# EAGLE design PEAWS (EAGLE 7.2.0)

## Sheet 1 of 5
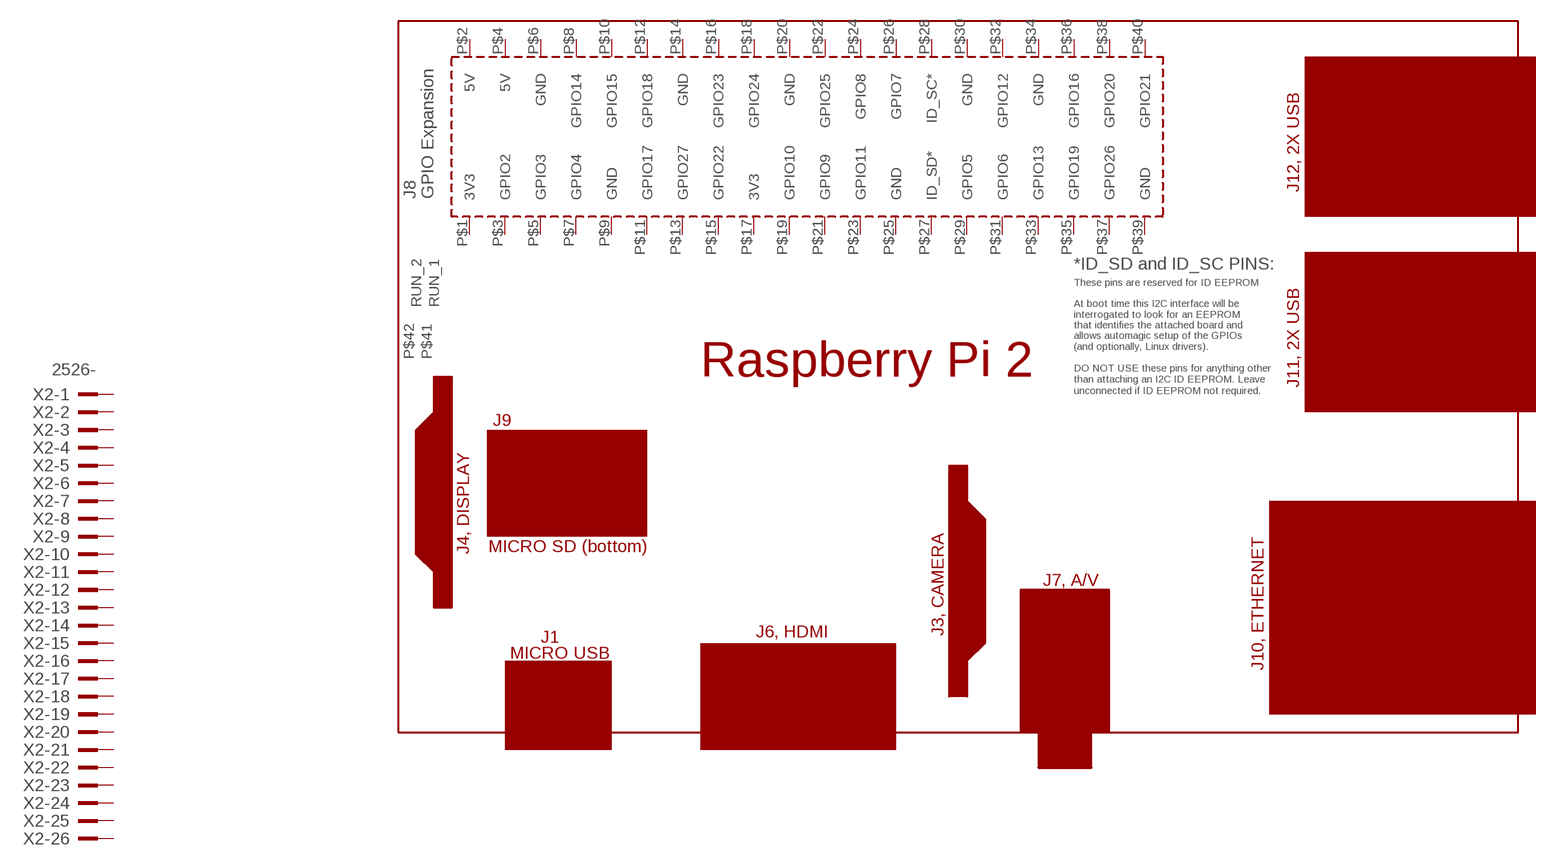
[diagram p0: schematic, sheet 1]

### Parts
PCB1  RPI2  [RPI2]
X2  2526-  [PAK100/2500-26]
Unconnected: PCB1.P$1(3V3) PCB1.P$2(5V) PCB1.P$3(GPIO2) PCB1.P$4(5V) PCB1.P$5(GPIO3) PCB1.P$6(GND) PCB1.P$7(GPIO4) PCB1.P$8(GPIO14) PCB1.P$9(GND) PCB1.P$10(GPIO15) PCB1.P$11(GPIO17) PCB1.P$12(GPIO18) PCB1.P$13(GPIO27) PCB1.P$14(GND) PCB1.P$15(GPIO22) PCB1.P$16(GPIO23) PCB1.P$17(3V3) PCB1.P$18(GPIO24) PCB1.P$19(GPIO10) PCB1.P$20(GND) PCB1.P$21(GPIO9) PCB1.P$22(GPIO25) PCB1.P$23(GPIO11) PCB1.P$24(GPIO8) PCB1.P$25(GND) PCB1.P$26(GPIO7) PCB1.P$27(ID_SD*) PCB1.P$28(ID_SC*) PCB1.P$29(GPIO5) PCB1.P$30(GND) PCB1.P$31(GPIO6) PCB1.P$32(GPIO12) PCB1.P$33(GPIO13) PCB1.P$34(GND) PCB1.P$35(GPIO19) PCB1.P$36(GPIO16) PCB1.P$37(GPIO26) PCB1.P$38(GPIO20) PCB1.P$39(GND) PCB1.P$40(GPIO21) PCB1.P$41(RUN_1) PCB1.P$42(RUN_2) X2.1 X2.2 X2.3 X2.4 X2.5 X2.6 X2.7 X2.8 X2.9 X2.10 X2.11 X2.12 X2.13 X2.14 X2.15 X2.16 X2.17 X2.18 X2.19 X2.20 X2.21 X2.22 X2.23 X2.24 X2.25 X2.26

## Sheet 2 of 5
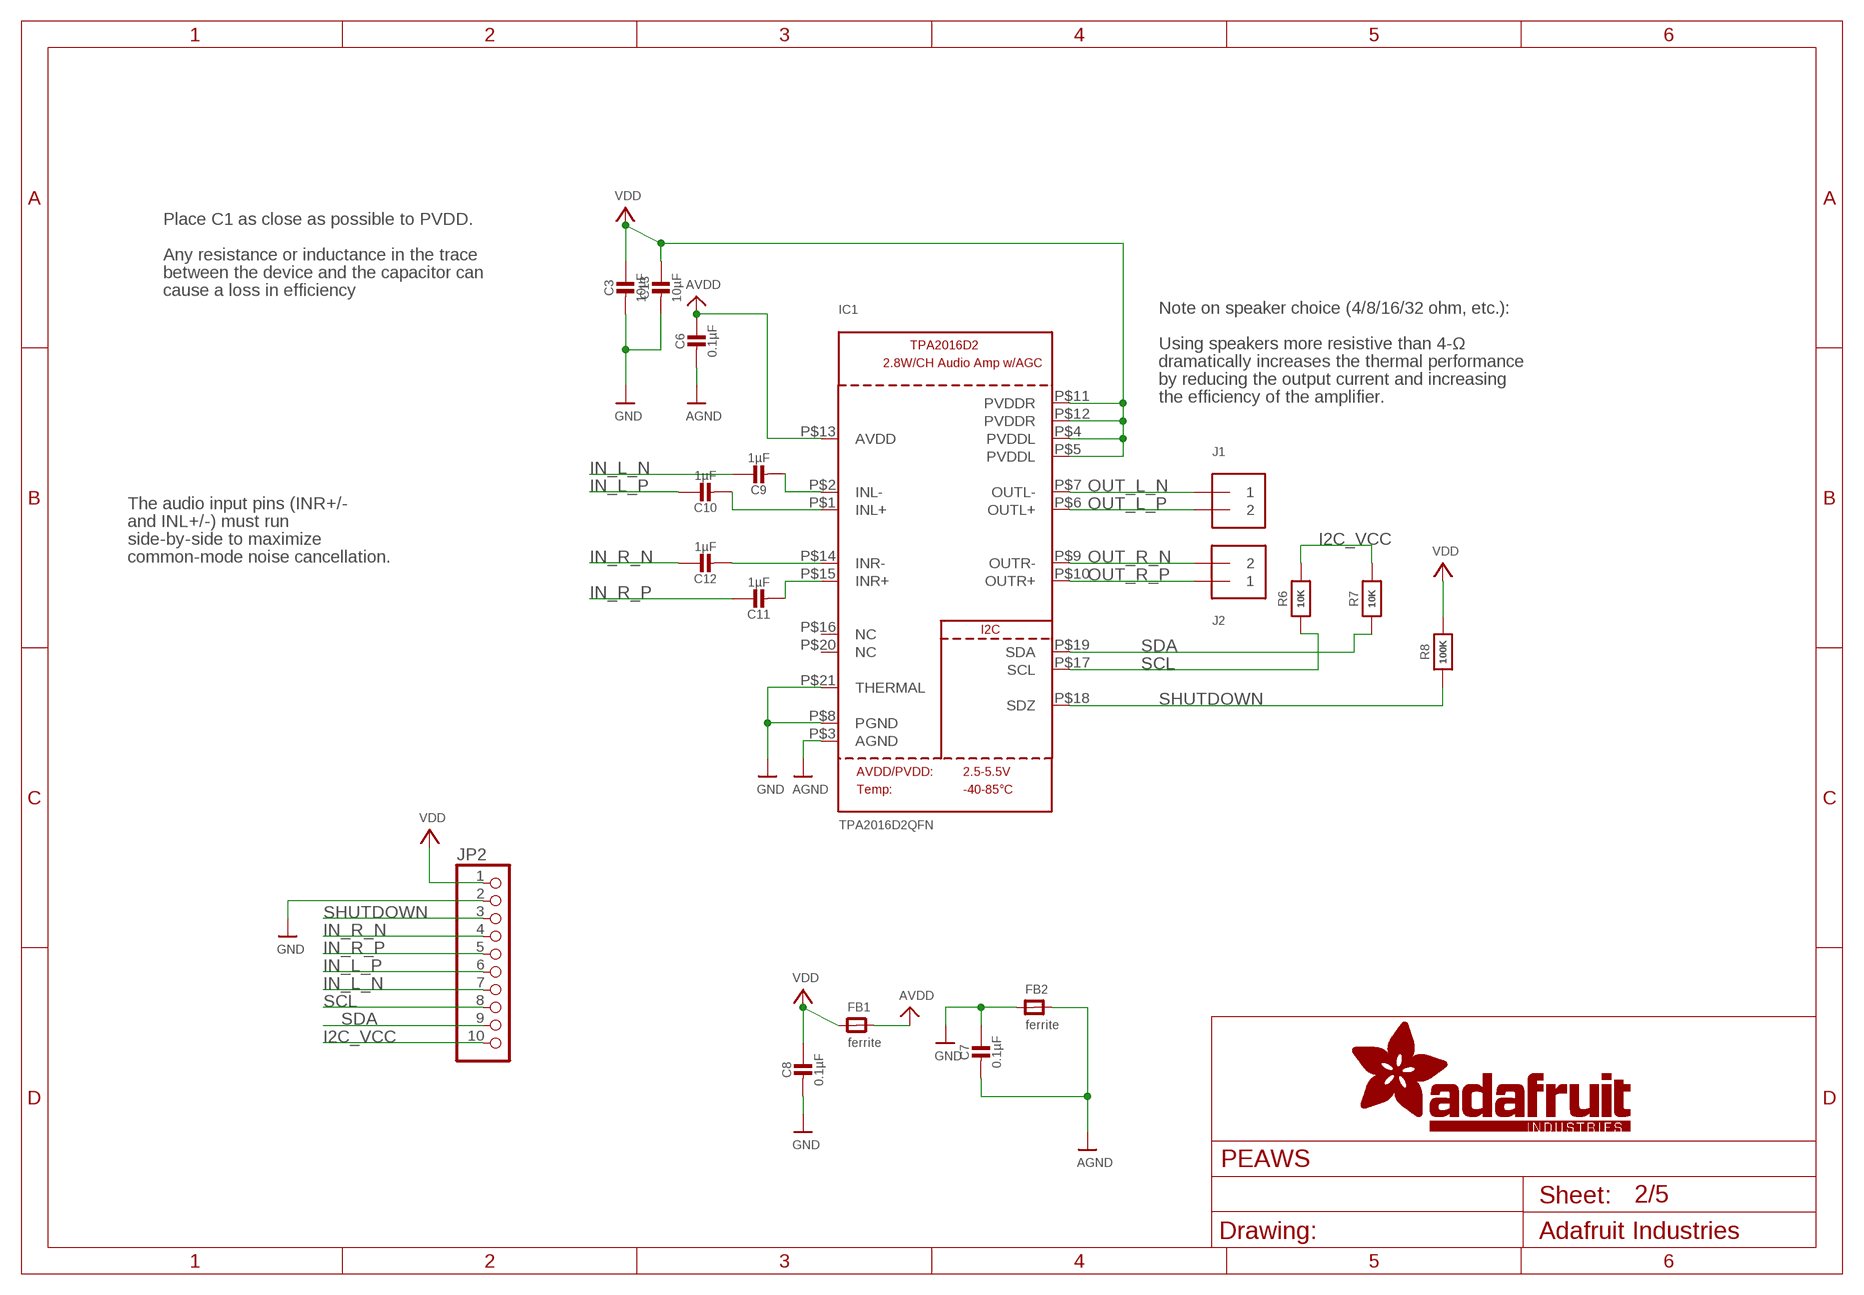
[diagram p1: schematic, sheet 2]

### Parts
C3  10µF  CAP_CERAMIC0805-NOOUTLINE  [0805-NO]
C6  0.1µF  CAP_CERAMIC0805-NOOUTLINE  [0805-NO]
C7  0.1µF  CAP_CERAMIC0805-NOOUTLINE  [0805-NO]
C8  0.1µF  CAP_CERAMIC0805-NOOUTLINE  [0805-NO]
C9  1µF  CAP_CERAMIC0805-NOOUTLINE  [0805-NO]
C10  1µF  CAP_CERAMIC0805-NOOUTLINE  [0805-NO]
C11  1µF  CAP_CERAMIC0805-NOOUTLINE  [0805-NO]
C12  1µF  CAP_CERAMIC0805-NOOUTLINE  [0805-NO]
C13  10µF  CAP_CERAMIC0805-NOOUTLINE  [0805-NO]
FB1  ferrite  FERRITE_0805MP  [_0805MP]
FB2  ferrite  FERRITE_0805MP  [_0805MP]
IC1  TPA2016D2QFN  [QFN20_4MM]
J1  TERMBLOCK_1X2  [TERMBLOCK_1X2-3.5MM]
J2  TERMBLOCK_1X2  [TERMBLOCK_1X2-3.5MM]
JP2  HEADER-1X1070MIL  [1X10_ROUND70]
R6  10K  RESISTOR0805_NOOUTLINE  [0805-NO]
R7  10K  RESISTOR0805_NOOUTLINE  [0805-NO]
R8  100K  RESISTOR0805_NOOUTLINE  [0805-NO]

### Nets
AGND: C6.2 C7.2 FB2.2 IC1.P$3(AGND)
AVDD: C6.1 FB1.2 IC1.P$13(AVDD)
GND: C3.2 C7.1 C8.2 C13.2 FB2.1 IC1.P$8(PGND) IC1.P$21(THERMAL) JP2.2 ; also sheet 3,4,5
I2C_VCC: JP2.10 R6.2 R7.2
IN_L_N: C9.1 JP2.7
IN_L_P: C10.1 JP2.6
IN_R_N: C12.1 JP2.4
IN_R_P: C11.1 JP2.5
N$6: C10.2 IC1.P$1(INL+)
N$7: C9.2 IC1.P$2(INL-)
N$8: C12.2 IC1.P$14(INR-)
N$9: C11.2 IC1.P$15(INR+)
OUT_L_N: IC1.P$7(OUTL-) J1.1
OUT_L_P: IC1.P$6(OUTL+) J1.2
OUT_R_N: IC1.P$9(OUTR-) J2.2
OUT_R_P: IC1.P$10(OUTR+) J2.1
SCL: IC1.P$17(SCL) JP2.8 R6.1
SDA: IC1.P$19(SDA) JP2.9 R7.1
SHUTDOWN: IC1.P$18(SDZ) JP2.3 R8.1
VDD: C3.1 C8.1 C13.1 FB1.1 IC1.P$4(PVDDL) IC1.P$5(PVDDL) IC1.P$11(PVDDR) IC1.P$12(PVDDR) JP2.1 R8.2 ; also sheet 3
Unconnected: IC1.P$16(NC) IC1.P$20(NC)

### Notes on the sheet
- Place C1 as close as possible to PVDD.
- Any resistance or inductance in the trace
- between the device and the capacitor can
- cause a loss in efficiency
- Note on speaker choice (4/8/16/32 ohm, etc.):
- Using speakers more resistive than 4-Ω
- dramatically increases the thermal performance
- by reducing the output current and increasing
- the efficiency of the amplifier.
- The audio input pins (INR+/-
- and INL+/-) must run
- side-by-side to maximize
- common-mode noise cancellation.

## Sheet 3 of 5
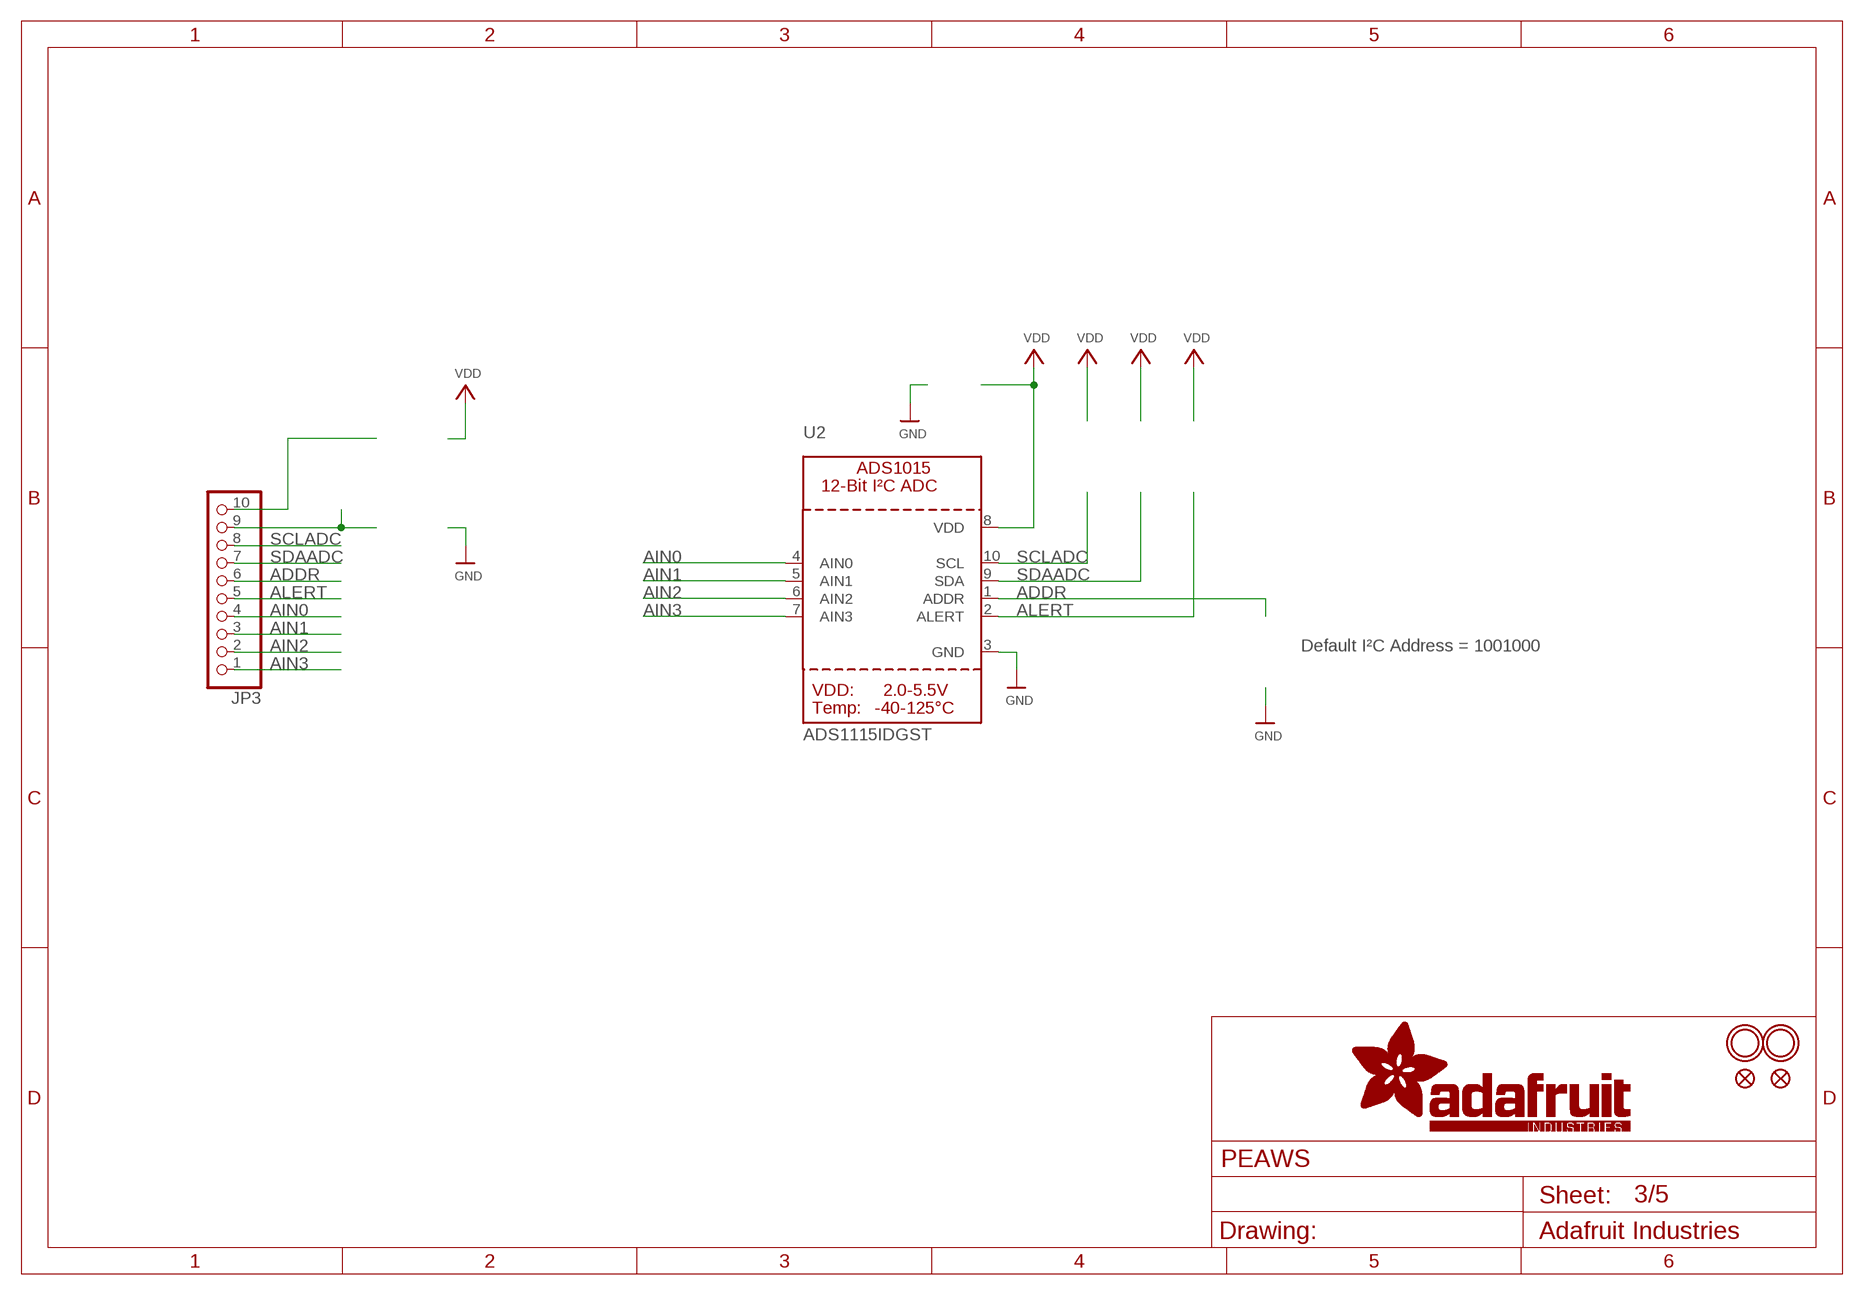
[diagram p2: schematic, sheet 3]

### Parts
FID1  FIDUCIAL""  [FIDUCIAL_1MM]
FID2  FIDUCIAL""  [FIDUCIAL_1MM]
JP3  HEADER-1X1070MIL  [1X10_ROUND70]
U2  ADS1115IDGST  ADC_ADS1015  [MSOP10]
U$55  MOUNTINGHOLE2.5  [MOUNTINGHOLE_2.5_PLATED]
U$56  MOUNTINGHOLE2.5  [MOUNTINGHOLE_2.5_PLATED]

### Nets
ADDR: JP3.6 U2.1(ADDR)
AIN0: JP3.4 U2.4(AIN0)
AIN1: JP3.3 U2.5(AIN1)
AIN2: JP3.2 U2.6(AIN2)
AIN3: JP3.1 U2.7(AIN3)
ALERT: JP3.5 U2.2(ALERT)
GND: U2.3(GND) ; also sheet 2,4,5
N$11: JP3.9
N$12: JP3.10
SCLADC: JP3.8 U2.10(SCL)
SDAADC: JP3.7 U2.9(SDA)
VDD: U2.8(VDD) ; also sheet 2

### Notes on the sheet
- Default I²C Address = 1001000

## Sheet 4 of 5
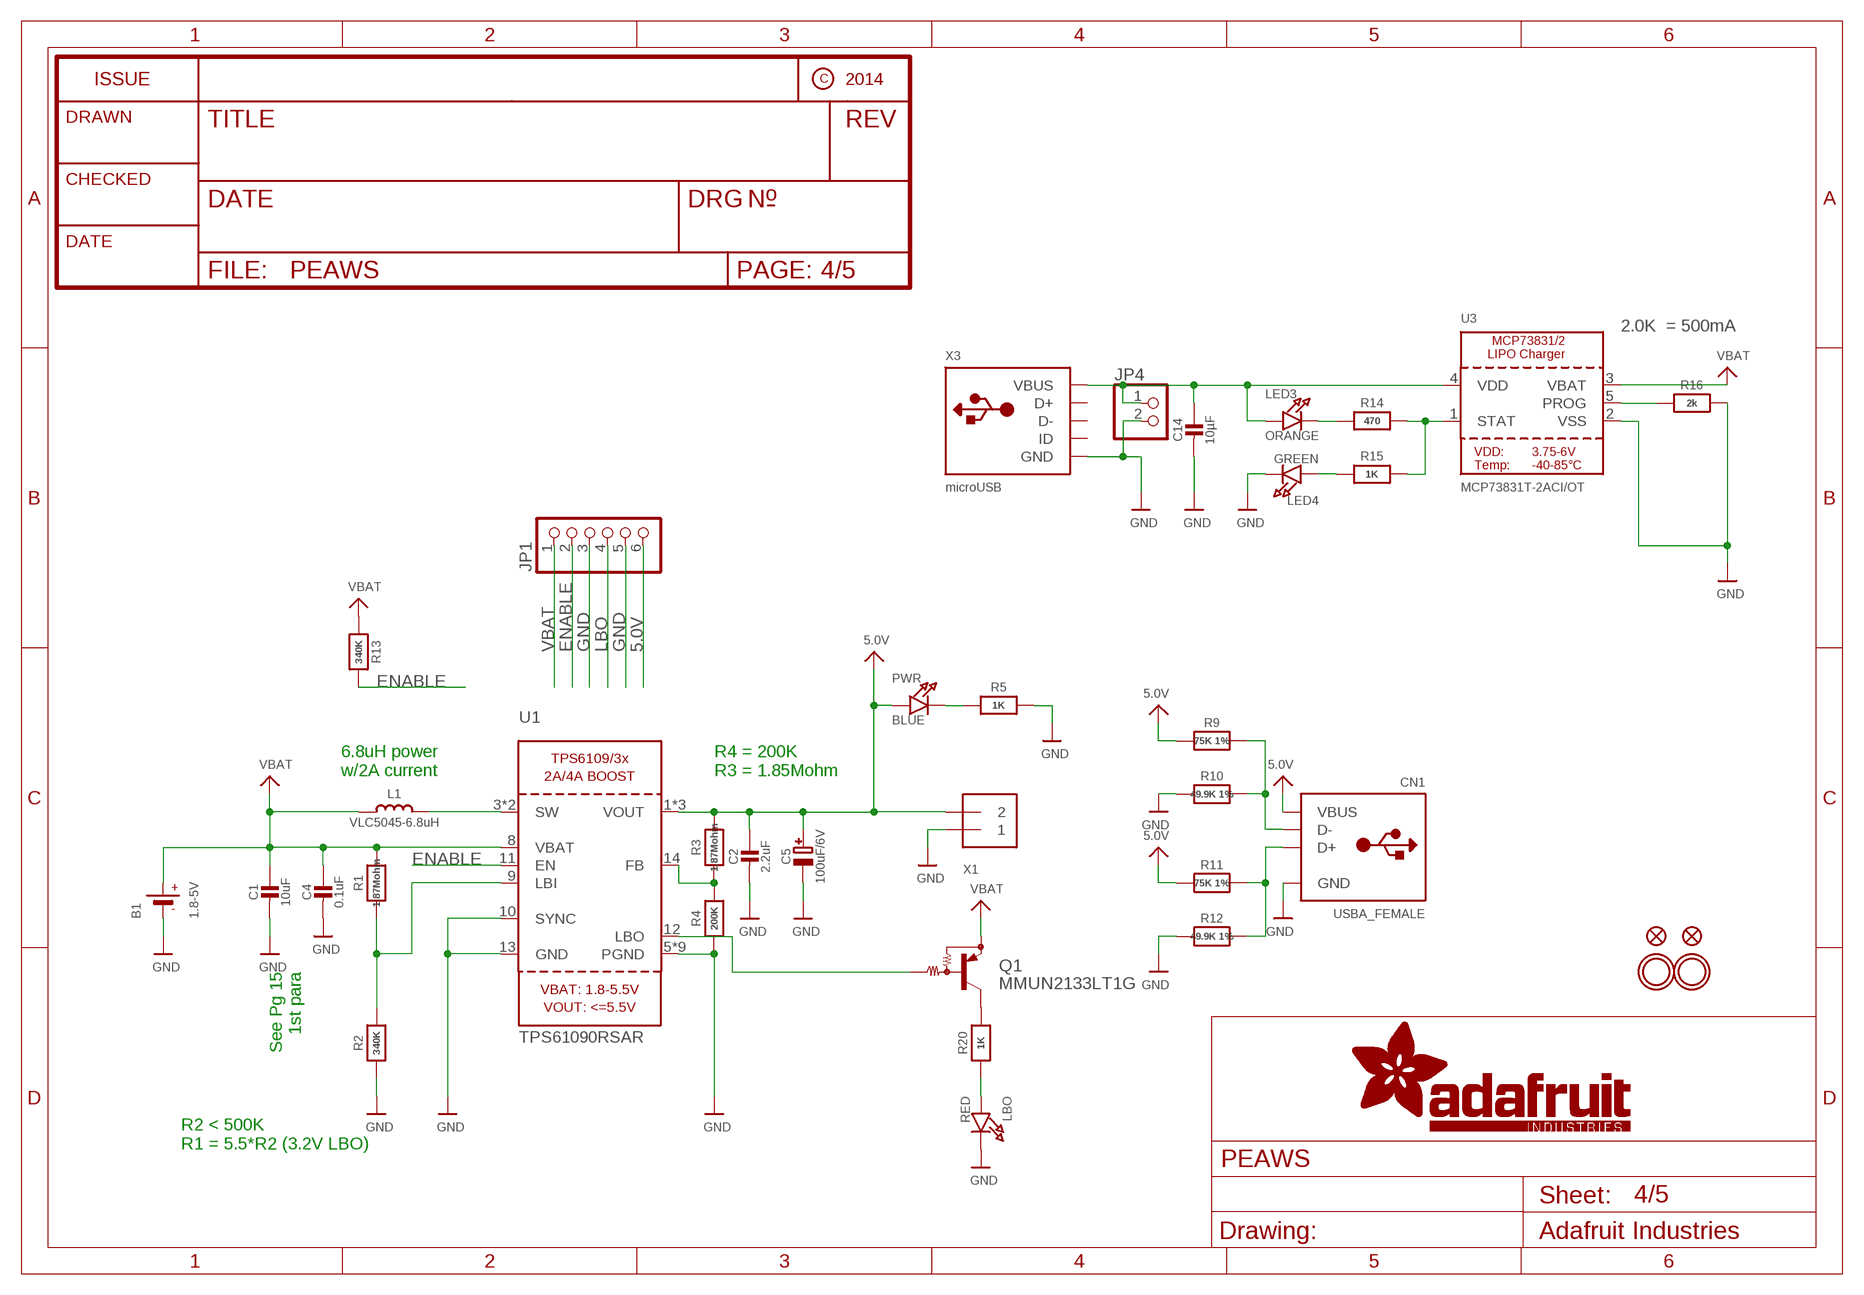
[diagram p3: schematic, sheet 4]

### Parts
B1  1.8-5V  BATTERY  [JSTPH2]
C1  10uF  CAP_CERAMIC0805-NOOUTLINE  [0805-NO]
C2  2.2uF  CAP_CERAMIC0805-NOOUTLINE  [0805-NO]
C4  0.1uF  CAP_CERAMIC0805-NOOUTLINE  [0805-NO]
C5  100uF/6V  CAP_TANTALUMB/3528_REFLOW  [EIA3528-21/B-R]
C14  10µF  CAP_CERAMIC0805-NOOUTLINE  [0805-NO]
CN1  USBA_FEMALE  USB_TYPEAPTHFML  [USB_HOST-PTH]
FID3  FIDUCIAL""  [FIDUCIAL_1MM]
FID4  FIDUCIAL""  [FIDUCIAL_1MM]
JP1  PINHD-1X6CB  [1X06-CLEANBIG]
JP4  HEADER-1X2ROUND  [1X02_ROUND]
L1  VLC5045-6.8uH  INDUCTORTDK_VLC5045  [INDUCTOR_5X5MM_TDK_VLC5045]
LBO  RED  LED0805_NOOUTLINE  [CHIPLED_0805_NOOUTLINE]
LED3  ORANGE  LED0805_NOOUTLINE  [CHIPLED_0805_NOOUTLINE]
LED4  GREEN  LED0805_NOOUTLINE  [CHIPLED_0805_NOOUTLINE]
PWR  BLUE  LED0805_NOOUTLINE  [CHIPLED_0805_NOOUTLINE]
Q1  MMUN2133LT1G  MUN2114T1-PNP_DRIVER-SC59-BEC  [SC59-BEC]
R1  1.87Mohm  RESISTOR0805_NOOUTLINE  [0805-NO]
R2  340K  RESISTOR0805_NOOUTLINE  [0805-NO]
R3  1.87Mohm  RESISTOR0805_NOOUTLINE  [0805-NO]
R4  200K  RESISTOR0805_NOOUTLINE  [0805-NO]
R5  1K  RESISTOR0805_NOOUTLINE  [0805-NO]
R9  75K 1%  RESISTOR0805_NOOUTLINE  [0805-NO]
R10  49.9K 1%  RESISTOR0805_NOOUTLINE  [0805-NO]
R11  75K 1%  RESISTOR0805_NOOUTLINE  [0805-NO]
R12  49.9K 1%  RESISTOR0805_NOOUTLINE  [0805-NO]
R13  340K  RESISTOR0805_NOOUTLINE  [0805-NO]
R14  470  RESISTOR0805_NOOUTLINE  [0805-NO]
R15  1K  RESISTOR0805_NOOUTLINE  [0805-NO]
R16  2k  RESISTOR0805_NOOUTLINE  [0805-NO]
R20  1K  RESISTOR0805_NOOUTLINE  [0805-NO]
U1  TPS61090RSAR  VREG_TPS6103X  [PVQFN-16]
U3  MCP73831T-2ACI/OT  MCP73831/2  [SOT23-5]
U$3  MOUNTINGHOLE2.5  [MOUNTINGHOLE_2.5_PLATED]
U$6  MOUNTINGHOLE2.5  [MOUNTINGHOLE_2.5_PLATED]
X1  TERMBLOCK_1X2  [TERMBLOCK_1X2-3.5MM]
X3  microUSB  USBMICRO_20329  [4UCONN_20329]

### Nets
5.0V: C2.1 C5.+ CN1.VBUS JP1.6 PWR.A R3.2 R9.2 R11.2 U1.1(VOUT) U1.15(VOUT) U1.16(VOUT) X1.2 ; also sheet 5
D+: CN1.D+ R11.1 R12.1
D-: CN1.D- R9.1 R10.1
ENABLE: JP1.2 R13.2 U1.11(EN)
GND: B1.1(-) C1.2 C2.2 C4.2 C5.- C14.2 CN1.GND JP1.3 JP1.5 JP4.2 LBO.C LED4.C R2.1 R4.1 R5.2 R10.2 R12.2 R16.2 U1.5(PGND) U1.6(PGND) U1.7(PGND) U1.10(SYNC) U1.13(GND) U1.P$18(PGND) U1.P$19(PGND) U1.P$20(PGND) U1.P$21(PGND) U1.P$22(PGND) U1.THERMAL(PGND) U3.2(VSS) X1.1 X3.BASE@1(GND) X3.BASE@2(GND) X3.GND X3.SPRT@1(GND) X3.SPRT@2(GND) X3.SPRT@3(GND) X3.SPRT@4(GND) ; also sheet 2,3,5
LBO: JP1.4 Q1.B U1.12(LBO)
N$25: L1.P$2 U1.3(SW) U1.4(SW)
N$26: R1.1 R2.2 U1.9(LBI)
N$27: PWR.C R5.1
N$28: R3.1 R4.2 U1.14(FB)
N$29: LBO.A R20.1
N$30: Q1.C R20.2
N$31: LED3.C R14.1
N$32: R14.2 R15.2 U3.1(STAT)
N$33: R16.1 U3.5(PROG)
N$34: LED4.A R15.1
VBAT: B1.2(+) C1.1 C4.1 JP1.1 L1.P$1 Q1.E R1.2 R13.1 U1.8(VBAT) U3.3(VBAT)
VDD1: C14.1 JP4.1 LED3.A U3.4(VDD) X3.VBUS
Unconnected: X3.D+ X3.D- X3.ID

### Notes on the sheet
- 2.0K  = 500mA
- 6.8uH power
  w/2A current
- R4 = 200K
  R3 = 1.85Mohm
- See Pg 15
  1st para
- R2 < 500K
  R1 = 5.5*R2 (3.2V LBO)

## Sheet 5 of 5
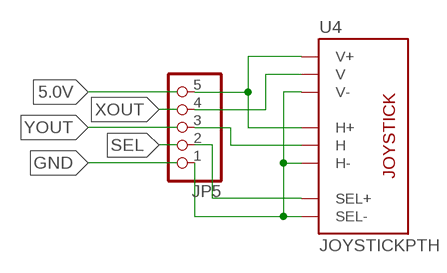
[diagram p4: schematic, sheet 5]

### Parts
JP5  PINHD-1X5  [1X05]
U4  JOYSTICKPTH  [JOYSTICK]

### Nets
N$1: JP5.5 U4.H1(H+) U4.V1(V+)
N$2: JP5.1 U4.B2A(SEL-) U4.H3(H-) U4.V3(V-)
N$3: JP5.4 U4.V2(V)
N$4: JP5.3 U4.H2(H)
N$5: JP5.2 U4.B1A(SEL+)

## Library data of the parts
B1 = microbuilder:BATTERY: CR1220 SMT - Digikey: 3001K-ND CD2032 BAT-HLD-001 - Digikey: BAT-HLD-001-ND
C1-C4 C6-C14 = microbuilder:CAP_CERAMIC: Ceramic Capacitors For new designs, use the packages preceded by an '_' character since they are more reliable: The following footprints should be used on most boards: _0402 - Standard footprint for regular board layouts _0603 - Standard footprint for regular board layouts _0805 - Standard footprint for regular board layouts _1206 - Standard footprint for regular board layouts For extremely tight-pitch boards where space is at a premium, the following 'micro-pitch' footprints can be used (smaller pads, no silkscreen outline, etc.): _0402MP - Micro-pitch footprint for very dense/compact boards _0603MP - Micro-pitch footprint for very dense/compact boards _0805MP - Micro-pitch footprint for very dense/compact boards _1206MP - Micro-pitch footprint for very dense/compact boards
C5 = microbuilder:CAP_TANTALUM: Tantalum Capacitors Wave footprints have larger pads and are meant to be used for hand soldering. Reflow footprints are optimised for solder paste and a reflow oven. EIA3216-18/A-[R/W] - Size A / 3216-18 / 1206 footprint 4.7µF 25V 10% Tantalum Capacitor 10µF 16V 10% Tantalum Capacitor [Digikey: 495-2236-2-ND] EIA3528-21/B-[R/W] - Size B / 3528-21 47µF 10V 10% Tantalum Capactior [Digikey: 495-2216-1-ND] EIA6032-28/C-[R/W] - Size C / 6032-28 10µF 35V 20% Tantalum Capacitor [Digikey: 495-2285-1-ND] 100µF 16V 10% Tantalum Capactior [Digikey: 399-5214-1-ND]
CN1 = microbuilder:USB_TYPEA: USB - Type A Connectors Male types stick out and are inserted into a PC or matching females parts (these are the connectors used on USB Memory Sticks, etc.). Female parts are generally used for USB Host and accept a male-type connector. SMT - 4UCON: 10017 PTHFML - Digikey: 609-1045-ND, 4UCon: 05241 PCB - Use 2.0mm thick PCBs with this footprint
FB1 FB2 = microbuilder:FERRITE: Ferrite Bead 0603 MMZ1608B121C - 120 Ohm @ 100MHz, 600mA, 0.15 Ohm DC Resistance - Digikey: 445-2164-1-ND BK1608HW121-T - 120 Ohm, 600mA Ferrite Chip - Digikey: 587-1876-2-ND 0805 HZ0805B272R-10 - 2.7K Ohm @ 100MHz, 200mA, 0.8 Ohm DC Resistance - Digikey: 240-2504-1-ND (see also Murata BLM21BD272SN1L) MMZ2012Y152B - 1.5K Ohm @ 100MHz, 500mA, 0.4 Ohm DC Resistance - Digikey: 445-1560-1-ND - Mainly for high frequency (80-400MHz) MMZ2012R102A - 1K Ohm @ 100MHz, 500mA, 0.3 Ohm DC Resistance - Digikey: 445-1555-2-ND - More general purpose (10-200MHz)
FID1-FID4 = microbuilder:FIDUCIAL: Fiducial Alignment Points Various fiducial points for machine vision alignment.; BOM: EXCLUDE
IC1 = microbuilder:TPA2016D2
J1 J2 X1 = microbuilder:TERMBLOCK_1X2: 3.5mm Terminal block http://www.ladyada.net/library/pcb/eaglelibrary.html
JP1 = adafruit:PINHD-1X6: PIN HEADER
JP2 JP3 = microbuilder:HEADER-1X10: PIN HEADER
JP4 = microbuilder:HEADER-1X2: PIN HEADER
JP5 = pinhead:PINHD-1X5: PIN HEADER
L1 = microbuilder:INDUCTOR: Inductors 0603: 10nH Ceramic Inductor - microwire antenna/RF (Digikey: 712-1434-2-ND) 0805: 560nH Ceramic Inductor - RF (Digikey: 553-1047-1-ND) 270nH Ceramic Inductor - Q = 40@250MHz, +-5%, 1 Ohm DC Resistance (Digikey: 535-10506-2-ND) 1007 (2518 Metric) SMT: 10µH 10% 250mOhm 820mA 1007 Inductor (Digikey: 587-2189-1-ND) 22µH 10% 500mOhm 580mA 1007 Inductor (Digikey: 587-2190-1-ND) 47µH 10% 950mOhm 420mA 1007 Inductor (Digikey: 587-2191-1-ND) 47µH 5% 100mOhm 1A 1008 Inductor (Digikey: 732-1816-1-ND) 5.0x5.0mm (Taiyo Yuden NR5040 Series) 6.8µH 20% 2.3A 64mOhm Inductor (Digikey: 587-2374-2-ND) 5.0x5.0mm (TDK VLC5045 Series) 4.7µH 20% 3.3A 34mOhm Inductor (Digikey: 445-6526-1-ND) 6.8µH 20% 2.7A 46mOhm Inductor (Digikey: 445-6527-1-ND) 6.0x6.0mm (TDK VLC6045 Series) 4.7µH 20% 3.8A 27mOhm Inductor (Digikey: 445-6538-2-ND) 6.8µH 20% 3A 41mOhm Inductor (Digikey: 445-6540-1-ND) 6.2µH 30% 2.2A 45mOhm Inductor (Digikey: SRR5028-6R2YCT-ND) - Not TDK VLC6045 but footprint should match 6.0x6.0mm (TDK SLF6045 Series) 6.8uH 30% 2A 33mOhm Inductor (Digikey: 445-4572-1-ND, Mouser: 810-SLF645T6R8N2R0PF) 6.0x6.0mm (Sumida CDRH5D28 Series) 6.2uH 30% 1.8A 45mOhm Inductor (Digikey: 308-1542-1-ND) Taiyo Yuden NR3015T2R2M - 2.2uH 20% 1.5A (Digikey: 587-1648-2-ND, Mouser: 963-NR3015T2R2M) - Used with TI TPS62172 CoilCraft RFID Transponder Coil - MA5532-AE (For use with AS3935 Lightning Sensor)
LBO LED3 LED4 PWR = microbuilder:LED: LED 0603 - 0603 Surface Mount Package 2mA: Green LED - Low Power (3.9mcd, 2ma, 1.7Vf) - Digikey: 475-2709-2-ND Orange LED - Low Power (9.8mcd, 2ma, 1.8Vf) - Digikey: 475-1194-2-ND Red LED - Low Power (5mcd, 2ma, 1.8Vf) - Digikey: 475-1195-2-ND Yellow LED - Low Power (7mcd, 2ma, 1.8Vf) - Digikey: 475-1196-2-ND 5mA: Blue LED - Low Power (17mcd, 5ma, 2.9Vf) - Digikey: LNJ937W8CRACT-ND 0805 - 0805 Surface Mount Package 2mA: Red LED (8.8mcd, 2mA, 1.8Vf, Clear) - Low Power [Digikey: 475-2510-1-ND] Green LED (5mcd, 2mA, 1.8Vf, Clear) - Low Power [Digikey: 475-2730-1-ND] Yellow LED (11.3mcd, 2mA, 1.8Vf, Clear) - Low Power [Digikey: 475-2555-1-ND] 20mA: Red LED (104mcd, 20mA, Diffused) - LS R976 [Digikey: 475-1278-6-ND] Red LED (12mcd, 20mA, 2.0Vf, Clear) - APT2012EC [Digikey: 754-1128-1-ND] Green LED (15mcd, 20mA, 2.2Vf, Clear) - APT2012GC [Digikey: 754-1131-1-ND] Orange LED (160mcd, 20mA, 2.1Vf, Clear) - APT2012SECK [Digikey: 754-1130-1-ND] 1206 - 1206 Surface Mount Package Green LED (26mcd, 20mA, Diffused) - LG N971 [Digikey: 475-1407-6-ND] Red LED (15mcd, 20mA, Diffused) - LH N974 [Digikey: 475-1416-6-ND] Cree - Cree High-Power Surface Mount LEDs XPEBWT-L1-0000-00D50 - White 111lm 350mA 2.9Vf 6200K 110° XTEAWT-00-0000-00000LEE3 - White 114lm 350mA 2.85Vf 5000K 115° Everlight - Everlight 45-21 Series Surface Mount LEDs 45-21/QK2C-B2832AC2CB2/2T - Warm White 2000mcd 20mA 3.25Vf 3050K 120° 45-21/LK2C-B38452C4CB2/2T - Nuetral White 2000mcd 20mA 3.25Vf 4150K 120° 45-21/LK2C-B50634C6CB2/2T - Cold White 2200mcd 20mA 3.25Vf 5650K 120° PLCC2 Reverse Mount LS T77K-J1L2-1-0-2-R18-Z - Red 11.25mcd 2mA 1.8Vf 630nm 120° LO T77K-L1M2-24-Z - Orange 19.6mcd 2mA 1.8Vf 606nm 120° LY T77K-K2M1-26-Z - Yellow 15.7mcd 2mA 1.8Vf 587nm 120°
PCB1 = e14_Rpi2_RevA:RPI2: Device for Raspberry Pi 2 board created by www.element14.com More information and support community is available at http://www.element14.com/community/community/raspberry-pi/raspberrypi2
Q1 = transistor:*-PNP_DRIVER-: PNP Bias Resistor Transistor
R1-R16 R20 = microbuilder:RESISTOR: Resistors For new designs, use the packages preceded by an '_' character since they are more reliable: The following footprints should be used on most boards: _0402 - Standard footprint for regular board layouts _0603 - Standard footprint for regular board layouts _0805 - Standard footprint for regular board layouts _1206 - Standard footprint for regular board layouts For extremely tight-pitch boards where space is at a premium, the following 'micro-pitch' footprints can be used (smaller pads, no silkscreen outline, etc.): _0402MP - Micro-pitch footprint for very dense/compact boards _0603MP - Micro-pitch footprint for very dense/compact boards _0805MP - Micro-pitch footprint for very dense/compact boards _1206MP - Micro-pitch footprint for very dense/compact boards
U1 = microbuilder:VREG_TPS6103X: TPS6103x 4A Boost - 1.8-5.5V Input, Adjustable Output to 5.5V
U2 = microbuilder:ADC_ADS1015: ADS1015 - 12-bit 4-Channel I2C ADC with Internal PGA VDD: 2.0-5.5V Sampling Rate: 3.3ksps Gain Settings: 2/3, 1, 2, 4, 8, 16 I2C Address: ADDR low = 1001000x, ADDR high = 1001001x Internal Comparator The ADS1015 includes an internal comparator that can be set to output a high-level on ALERT when the conversion results exceeeds a pre-defined upper level, and will deassert itself when the level falls below a pre-defined lower threshold level. It can also be set to windowed mode where the ALERT pin will be asserted if the data exceeds the upper threshold or falls below the lower threshold.
U3 = microbuilder:MCP73831/2: MCP73831/2 LIPO Charger VDD: 3.75 - 6V Temp -40 - 85°C Programmable Charge Rate: 15-500mA NOTE: STAT is a tri-state logic output on the MCP73831 and an open-drain output on the MCP73832. SOT23-5 with 4.2V output and tri-state logic on STAT = MCP73831T-2ACI/OT
U4 = adafruit:JOYSTICK: Thumb Joystick Joystick commonly found in PS2 controllers. Two pots and a select switch. Adapted from Sparkfun Library (but for more common 6mm switch sticks)
U$3 U$6 U$55 U$56 = microbuilder:MOUNTINGHOLE: Mounting Hole For #2 screws (0.086"/2.18mm width, 0.094"/2.4mm hole) use 2.5mm; BOM: EXCLUDE
X2 = con-3m:2526-: 3M (TM) Pak 100 4-Wall Header Source: 3M; OC_FARNELL: unknown; OC_NEWARK: unknown
X3 = microbuilder:USB: USB Connectors USBMINIB - Surface Mount Female Mini-B USB Connector 4UConnector: 06564

## Board
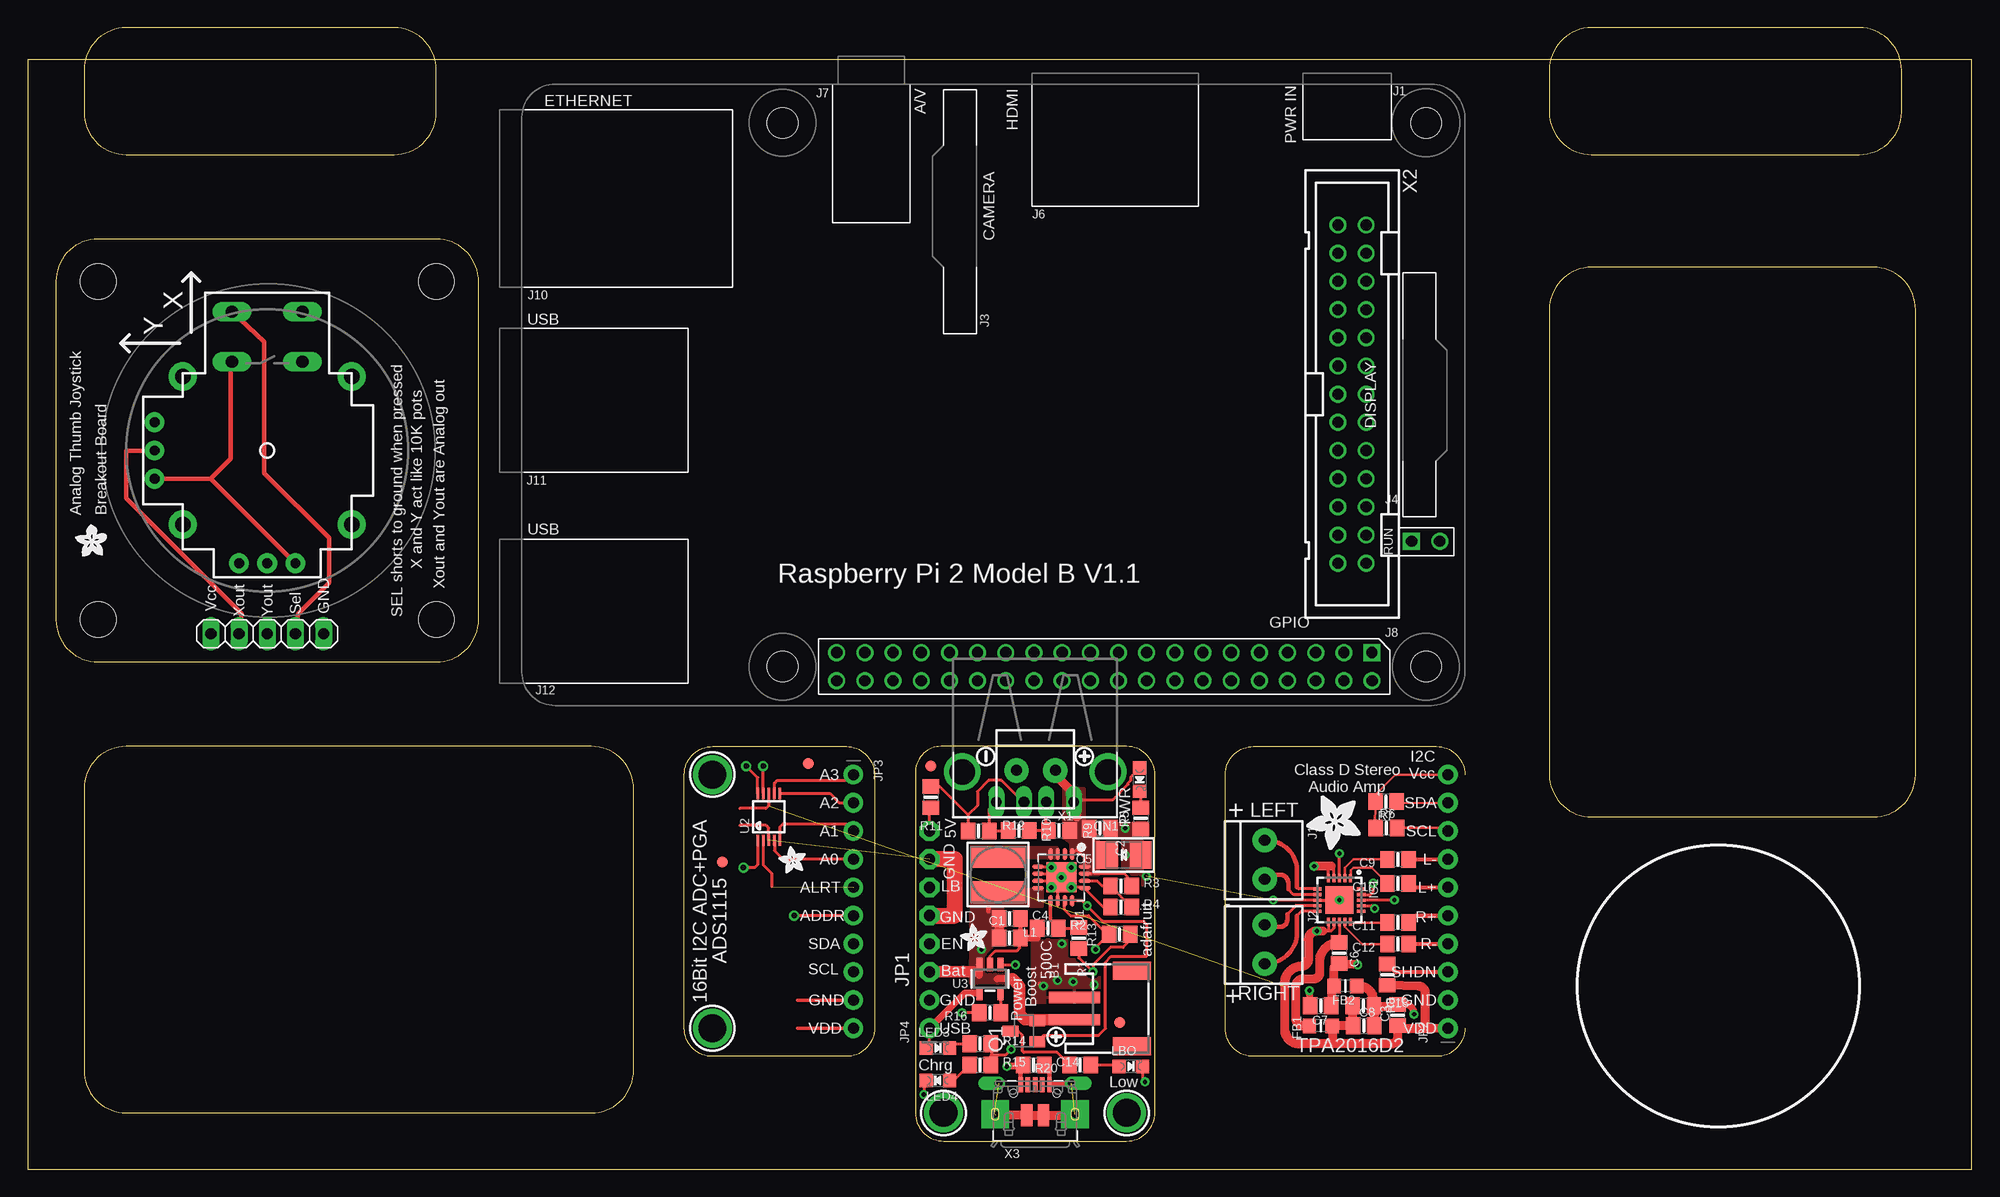
[diagram p5: board, top side]
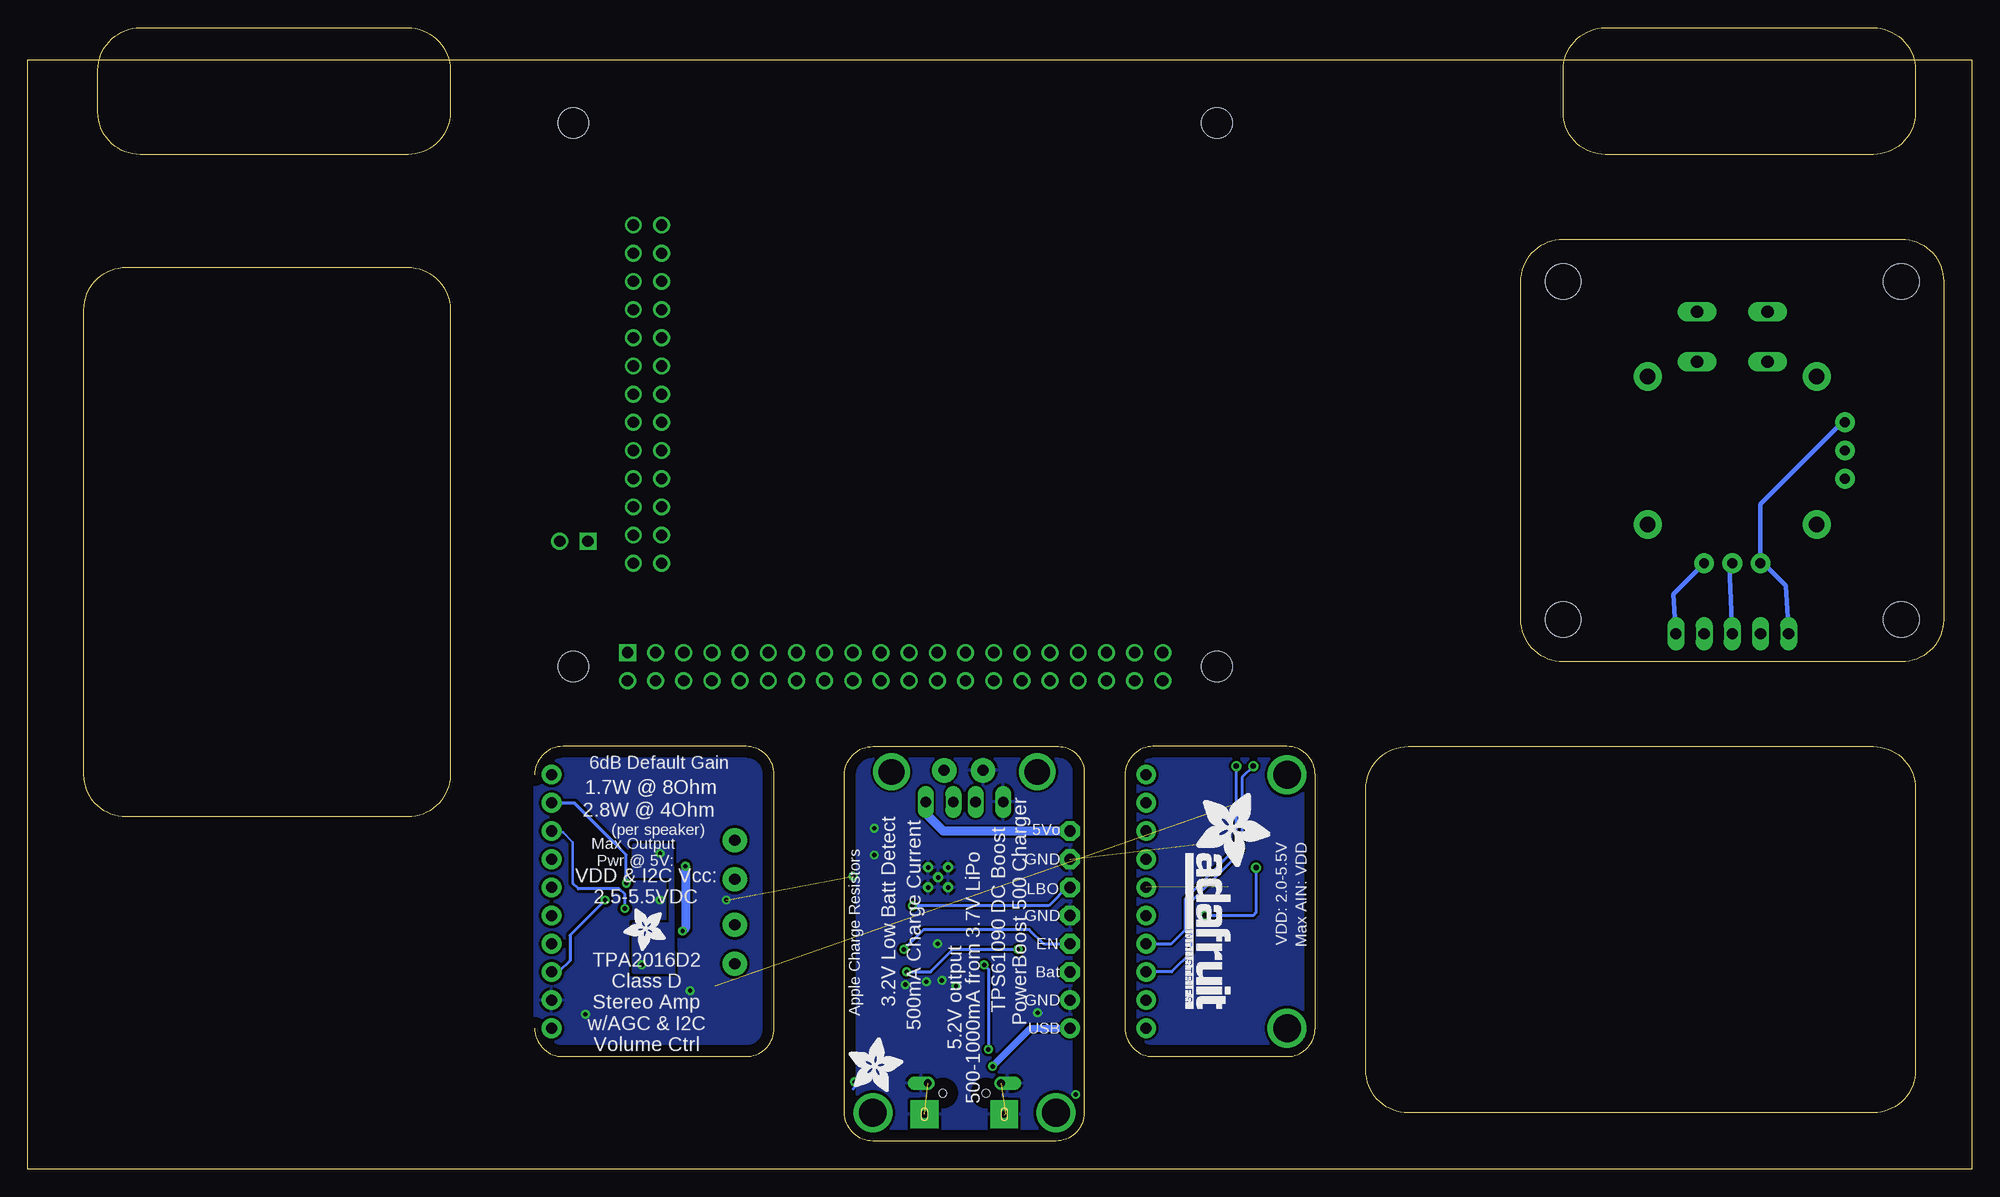
[diagram p6: board, bottom side, seen from below]

Size 175.24 x 102.87 mm. Coordinates in mm from the lower left corner, seen from the top.
Outline: 129.54,35.56 arc90 127,38.1 110.49,38.1 arc90 107.95,35.56 107.95,12.7 arc90 110.49,10.16 127,10.16 arc90 129.54,12.7
Outline: 0,0 175.24,0 175.24,100 0,100 0,0
Outline: 61.72,38.1 73.79,38.1 arc-90 76.33,35.56 76.33,12.7 arc-90 73.79,10.16 61.72,10.16 arc-90 59.18,12.7 59.18,35.56 arc-90 61.72,38.1
Outline: 82.55,2.54 99.06,2.54 arc90 101.6,5.08 101.6,35.56 arc90 99.06,38.1 82.55,38.1 arc90 80.01,35.94 80.01,5.08 arc90 82.55,2.54
Outline: 36.83,45.72 arc90 40.64,49.53 40.64,80.01 arc90 36.83,83.82 6.35,83.82 arc90 2.54,80.01 2.54,49.53 arc90 6.35,45.72 36.83,45.72
Outline: 50.8,38.1 8.89,38.1 arc90 5.08,34.29 5.08,8.89 arc90 8.89,5.08 50.8,5.08 arc90 54.61,8.89 54.61,34.29 arc90 50.8,38.1
Outline: 137.16,77.47 137.16,35.56 arc90 140.97,31.75 166.37,31.75 arc90 170.18,35.56 170.18,77.47 arc90 166.37,81.28 140.97,81.28 arc90 137.16,77.47
Outline: 140.97,91.44 165.1,91.44 arc90 168.91,95.25 168.91,99.06 arc90 165.1,102.87 140.97,102.87 arc90 137.16,99.06 137.16,95.25 arc90 140.97,91.44
Outline: 8.89,91.44 33.02,91.44 arc90 36.83,95.25 36.83,99.06 arc90 33.02,102.87 8.89,102.87 arc90 5.08,99.06 5.08,95.25 arc90 8.89,91.44
Copper layers (1*16): Top 0.035mm / dielectric 1.5mm / Bottom 0.035mm
Design rules "default": minimum track width 10mil, minimum drill 24mil, track to track 8mil, track to pad 8mil, pad to pad 8mil, via to via 8mil, smd to smd 8mil, copper to edge 40mil, drill to drill 8mil, minimum pad ring 10mil, minimum via ring 8mil, stop-mask expansion 4mil, vias tented up to drill 0mil, thermal gap 10mil
Holes 3.2 mm at 6.35,49.53 6.35,80.01 36.83,80.01 36.83,49.53

### Footprints (pad centres in the part's own frame; a part is rotated, then mirrored left to right if it is on the bottom)
JSTPH2 = smd 1 x 4.6: 1 -1,-3.7; 2 1,-3.7 | smd 1.6 x 3.4: NC1 -3.4,1.5; NC2 3.4,1.5
0805-NO = smd 1.3 x 1.5: 1 -0.95,0; 2 0.95,0
EIA3528-21/B-R = smd 1.95 x 2.5: + 1.525,0; - -1.525,0
USB_HOST-PTH = drill 0.95 long: D+ 1,6.52; D- -1,6.52; GND 3.5,6.52; VBUS -3.5,6.52 | drill 2.3 pad 2.9: S1 -6.57,3.81; S2 6.57,3.81
_0805MP = smd 1.2 x 1.3: 1 -1.016,0; 2 1.016,0
FIDUCIAL_1MM = smd 1 x 1: 1 0,0
QFN20_4MM = smd 0.73 x 0.28: P$1 -1.965,1; P$2 -1.965,0.5; P$3 -1.965,0; P$4 -1.965,-0.5; P$5 -1.965,-1; P$11 1.965,-1; P$12 1.965,-0.5; P$13 1.965,0; P$14 1.965,0.5; P$15 1.965,1 | smd 0.28 x 0.73: P$6 -1,-1.965; P$7 -0.5,-1.965; P$8 0,-1.965; P$9 0.5,-1.965; P$10 1,-1.965; P$16 1,1.965; P$17 0.5,1.965; P$18 0,1.965; P$19 -0.5,1.965; P$20 -1,1.965 | smd 2.5 x 2.5: P$21 0,0
TERMBLOCK_1X2-3.5MM = drill 1 pad 2.184: 1 1.8,0; 2 -1.7,0
1X06-CLEANBIG = drill 1.016 pad 1.778 octagon: 1 -6.35,0; 2 -3.81,0; 3 -1.27,0; 4 1.27,0; 5 3.81,0; 6 6.35,0
1X10_ROUND70 = drill 1 pad 1.778: 1 -11.43,0; 2 -8.89,0; 3 -6.35,0; 4 -3.81,0; 5 -1.27,0; 6 1.27,0; 7 3.81,0; 8 6.35,0; 9 8.89,0; 10 11.43,0
1X02_ROUND = drill 1 pad 1.778: 1 -1.27,0; 2 1.27,0
1X05 = drill 1.016 long: 1 -5.08,0; 2 -2.54,0; 3 0,0; 4 2.54,0; 5 5.08,0
INDUCTOR_5X5MM_TDK_VLC5045 = smd 2 x 5: P$1 -1.6,0; P$2 1.6,0
CHIPLED_0805_NOOUTLINE = smd 1.2 x 1.2: A 0,-1.05; C 0,1.05
RPI2 = drill 1.016 square: P$1 8.37,51.23; P$41 4.8,41.2 | drill 1.016: P$2 8.357,53.772; P$3 10.897,51.232; P$4 10.897,53.772; P$5 13.437,51.232; P$6 13.437,53.772; P$7 15.977,51.232; P$8 15.977,53.772; P$9 18.517,51.232; P$10 18.517,53.772; P$11 21.057,51.232; P$12 21.057,53.772; P$13 23.597,51.232; P$14 23.597,53.772; P$15 26.137,51.232; P$16 26.137,53.772; P$17 28.677,51.232; P$18 28.677,53.772; P$19 31.217,51.232; P$20 31.217,53.772; P$21 33.757,51.232; P$22 33.757,53.772; P$23 36.297,51.232; P$24 36.297,53.772; P$25 38.837,51.232; P$26 38.837,53.772; P$27 41.377,51.232; P$28 41.377,53.772; P$29 43.917,51.232; P$30 43.917,53.772; P$31 46.457,51.232; P$32 46.457,53.772; P$33 48.997,51.232; P$34 48.997,53.772; P$35 51.537,51.232; P$36 51.537,53.772; P$37 54.077,51.232; P$38 54.077,53.772; P$39 56.617,51.232; P$40 56.617,53.772; P$42 2.26,41.2 | hole 2.75: 3.5,3.5; 61.5,3.5; 3.5,52.5; 61.5,52.5
SC59-BEC = smd 1 x 1.4: B -0.95,-1.2; C 0,1.2; E 0.95,-1.2
PVQFN-16 = smd 1.05 x 0.35: 1 -2.1,0.975; 2 -2.1,0.325; 3 -2.1,-0.325; 4 -2.1,-0.975; 9 2.1,-0.975; 10 2.1,-0.325; 11 2.1,0.325; 12 2.1,0.975 | smd 0.35 x 1.05: 5 -0.975,-2.1; 6 -0.325,-2.1; 7 0.325,-2.1; 8 0.975,-2.1; 13 0.975,2.1; 14 0.325,2.1; 15 -0.325,2.1; 16 -0.975,2.1 | drill 0.4: P$18 0,0; P$19 -0.9,0.9; P$20 0.9,0.9; P$21 0.9,-0.9; P$22 -0.9,-0.9 | smd 2.7 x 2.7: THERMAL 0,0
MSOP10 = smd 0.25 x 1: 1 -1,-2.113; 2 -0.5,-2.113; 3 0,-2.113; 4 0.5,-2.113; 5 1,-2.113; 6 1,2.113; 7 0.5,2.113; 8 0,2.113; 9 -0.5,2.113; 10 -1,2.113
SOT23-5 = smd 0.55 x 1.2: 1 -0.95,-1.3; 2 0,-1.3; 3 0.95,-1.3; 4 0.95,1.3; 5 -0.95,1.3
JOYSTICK = drill 1.1 pad 1.778 long: B1A -3.175,12.501; B1B 3.175,12.501; B2A -3.175,8.001; B2B 3.175,8.001 | drill 0.889 pad 1.778: H1 -2.54,-10.16; H2 0,-10.16; H3 2.54,-10.16; V1 -10.16,2.54; V2 -10.16,0; V3 -10.16,-2.54 | drill 1.397 pad 2.54: MOUNT1 -7.62,6.668; MOUNT2 -7.62,-6.668; MOUNT3 7.62,-6.668; MOUNT4 7.62,6.668
MOUNTINGHOLE_2.5_PLATED = drill 2.5 pad 3.2: P$1 0,0
PAK100/2500-26 = drill 1 pad 1.422: 1 -15.24,-1.27; 2 -15.24,1.27; 3 -12.7,-1.27; 4 -12.7,1.27; 5 -10.16,-1.27; 6 -10.16,1.27; 7 -7.62,-1.27; 8 -7.62,1.27; 9 -5.08,-1.27; 10 -5.08,1.27; 11 -2.54,-1.27; 12 -2.54,1.27; 13 0,-1.27; 14 0,1.27; 15 2.54,-1.27; 16 2.54,1.27; 17 5.08,-1.27; 18 5.08,1.27; 19 7.62,-1.27; 20 7.62,1.27; 21 10.16,-1.27; 22 10.16,1.27; 23 12.7,-1.27; 24 12.7,1.27; 25 15.24,-1.27; 26 15.24,1.27
4UCONN_20329 = smd 1 x 2: BASE@1 -0.75,-2; BASE@2 0.75,-2 | smd 0.4 x 1.35: D+ 0,0.775; D- -0.65,0.775; GND 1.3,0.775; ID 0.65,0.775; VBUS -1.3,0.775 | drill 0.7 offset: SPRT@1 -3.3,0.9; SPRT@2 3.3,0.9 | drill 0.6 pad 2.5 square: SPRT@3 -3.6,-1.9; SPRT@4 3.6,-1.9 | hole 0.7: -1.95,0; 1.95,0

### Placement (x,y rotation side)
B1  98.04,14.48 270 top
C1  88.52,20.83 0 top
C2  96.65,30.73 0 top
C3  123.49,13.89 90 top
C4  88.52,22.61 0 top
C5  98.81,28.32 180 top
C6  118.22,19.48 270 top
C7  116.56,14.73 0 top
C8  120.43,12.93 0 top
C9  123.51,27.91 180 top
C10  123.51,25.74 180 top
C11  123.51,22.23 180 top
C12  123.51,20.29 180 top
C13  120.4,14.73 0 top
C14  90.68,9.4 0 top
CN1  90.81,39.62 180 top
FB1  116.56,12.93 180 top
FB2  118.78,16.51 180 top
FID1  70.36,36.58 270 top
FID2  62.61,27.69 270 top
FID3  98.45,13.23 90 top
FID4  81.41,36.32 90 top
IC1  118.24,24.26 270 top
J1  111.51,27.94 270 top
J2  111.51,20.32 270 top
JP1  81.28,24.13 90 top
JP2  128.02,24.13 90 top
JP3  74.42,24.13 270 top
JP4  81.28,13.97 90 top
JP5  21.59,48.26 180 top
L1  87.47,26.56 90 top
LBO  99.44,9.27 270 top
LED3  82.04,10.92 270 top
LED4  82.04,8 90 top
PCB1  129.54,97.79 180 top
PWR  100.23,35.11 180 top
Q1  89.79,12.45 90 top
R1  94.74,20.83 270 top
R2  91.95,21.72 0 top
R3  98.55,25.53 0 top
R4  98.55,23.62 0 top
R5  100.33,31.62 270 top
R6  122.47,30.76 180 top
R7  122.44,33.12 180 top
R8  122.56,17.53 270 top
R9  92.96,30.53 0 top
R10  89.35,30.51 180 top
R11  81.41,33.53 270 top
R12  85.72,30.48 0 top
R13  98.43,21.18 180 top
R14  85.85,11.3 0 top
R15  85.85,9.4 0 top
R16  86.74,14.1 180 top
R20  94.87,9.4 180 top
U1  93.17,26.3 270 top
U2  66.8,31.75 0 top
U3  86.74,17.14 180 top
U4  21.59,64.77 0 top
U$3  82.55,5.08 90 top
U$6  99.06,5.08 90 top
U$13  [ADAFRUIT200MIL]  5.59,56.64 0 top
U$47  [ADAFRUIT_5MM]  120.14,33.66 180 top
U$48  [ADAFRUIT_3.5MM]  117.73,23.5 180 bottom
U$55  61.72,35.56 270 top
U$56  61.72,12.7 270 top
U$57  [ADAFRUIT_TEXT_20MM]  70.87,34.04 270 bottom
U$58  [ADAFRUIT_2.5MM]  70.1,26.67 90 top
U$67  [SYMBOL_PLUS]  92.71,11.94 90 top
U$68  [SYMBOL_PLUS]  95.25,37.21 90 top
U$69  [SYMBOL_MINUS]  86.36,37.21 90 top
U$70  [ADAFRUIT_2.5MM]  86.49,19.68 90 top
U$71  [ADAFRUIT_5MM]  101.22,6.99 0 bottom
X1  90.93,35.94 180 top
X2  119.38,69.85 270 top
X3  90.81,6.86 0 top

### Tracks (layer width: path | path; a pad name or v marks a point on that pad's centre or on a via)
5.0V
  Top 0.254: U1.1 94.55,28.81 95.27,28.09 U1.16 | 94.81,32 94.55,31.75 | JP1.6 81.28,32.45 R11.2 | 96.14,26.67 98.81,26.67 99.5,25.97 R3.2 | CN1.VBUS 94.47,33.27 97.79,33.27 99.19,34.67 99.19,34.8 99.44,35.05 99.44,35.37 PWR.A
  Top 0.305: U1.15 95.84,26.63
  Top 0.813: 94.55,31.75 94.55,32.6 | 94.61,33.16 94.61,33.53 92.63,35.51 X1.2
  Bottom 0.813: JP1.6 92.71,30.48 94.31,32.08 CN1.VBUS
  pour Top (no thermals): 95.5,26.54 96.52,26.54 96.52,30.1 95.25,30.1 95.25,34.29 93.34,34.29 93.34,29.84 93.47,29.84 93.98,29.34 93.98,28.57 95,28.57 95.5,28.07
ADDR  (via drill 0.5)
  Top 0.254: U2.1 65.8,27.45 65.53,27.18 v64.52,27.18 | JP3.6 v69.09,22.86
  Bottom 0.254: v64.52,27.18 64.52,23.11 64.77,22.86 v69.09,22.86
AGND  (via drill 0.39)
  Top 0.254: IC1.P$3 v118.24,28.45
  Top 0.813: C7.2 117.57,16.32 arc-90 FB2.2 117.76,18.01 arc-90 C6.2 119.84,18.46 arc-90 v119.89,18.41
  Bottom 0.254: v118.24,28.45 118.24,28.83
  pour Bottom (isolate 0.254): 116.97,17.73 117.1,29.21 120.67,29.21 120.65,26.42 117.35,26.42 117.35,22.1 120.65,22.1 120.65,17.73
AIN0
  Top 0.254: U2.4 67.3,28.71 68.07,27.94 JP3.4
AIN1
  Top 0.254: U2.5 67.8,30.84 68.07,31.11 73.79,31.11 JP3.3
AIN2
  Top 0.254: U2.6 72.31,33.86 73.15,33.02 JP3.2
AIN3
  Top 0.254: U2.7 67.3,34.79 67.56,35.05 73.66,35.05 JP3.1
ALERT  (1 unrouted)
  Top 0.254: U2.2 66.3,27.42 67.06,26.67 67.06,25.47
AVDD
  Top 0.254: IC1.P$13 118.24,20.51 C6.1
  Top 0.813: FB1.2 115.09,12.93 arc-90 114.3,13.59 114.3,16.51 arc-90 115.06,17.14 115.95,17.14 arc90 116.46,17.78 116.46,18.74 arc-90 C6.1
D+
  Top 0.254: R11.1 82.23,34.48 84.78,31.94 | 84.78,31.94 R12.1 | 89.81,32.88 CN1.D+ 89.7,33.1 87.76,35.05 86.61,35.05 85.6,34.04 85.6,32.76 84.78,31.94
D-
  Top 0.254: CN1.D- 91.81,30.74 R9.1 90.31,30.53 R10.1
ENABLE  (via drill 0.39)
  Top 0.254: U1.11 93.47,24.18 93.47,23.37 93.98,22.86 95.63,22.86 97.48,21.02 R13.2 | 97.54,21.24 R13.2 | v96.27,19.81 96.27,19.97 R13.2
  Bottom 0.254: v96.27,19.81 94.49,21.59 84.96,21.59 83.69,20.32 JP1.2
GND  (via drill 0.39)  (5 unrouted)
  Top 0.254: v112.27,24.26 IC1.P$8 IC1.P$21 | U2.3 66.8,30.73 66.55,30.99 64.2,30.99 | U1.P$21 92.68,25.81 | 92.68,25.81 U1.THERMAL | U1.THERMAL 92.69,26.78 | 92.69,26.78 U1.P$22 92.2,27.28 U1.5 | U1.THERMAL U1.P$19 | U1.THERMAL U1.P$20 95.2,25.4 U1.13 96.98,23.62 R4.1 | U1.10 92.85,25.98 U1.THERMAL | U1.7 92.51,25.98 92.68,25.81 | U1.6 92.54,26.63 92.69,26.78 | R10.2 88.36,30.48 R12.2 86.67,32.47 CN1.GND | LBO.C 100.49,8.09 v100.71,7.87 | LED4.C 80.77,7.78 v80.77,6.73 | R16.2 v84.2,14.1 | U3.2 86.74,19.18 87.25,19.68 89.15,19.68 89.41,19.94 89.41,20.77 C1.2
  Top 0.406: C1.2 C4.2 | C14.2 92.11,8.92 X3.GND 92.23,7.76 X3.SPRT@2 | 91.25,16.7 91.31,16.64
  Top 0.61: C7.1 v115.54,16.1 | C3.2 124.04,14.9 arc-90 v124.97,13.97 | R2.1 91,20.83 C1.2
  Top 0.813: C8.2 121.44,14.7 | 121.44,14.7 arc90 C13.2 arc-90 121.28,14.86 121.28,15.11 arc90 120.14,16.51 FB2.1 | 121.44,14.7 123.28,14.7 arc90 C3.2 | X3.SPRT@4 94.31,4.86 X3.BASE@2 X3.BASE@1 87.22,4.86 87.12,4.95
  Top 1.422: JP1.3 83.57,22.86 83.57,27.94 JP1.5
  Bottom 0.254: v100.71,7.87 100.71,7.37 100.84,7.24 | v80.77,6.73 80.9,6.6 | v84.2,14.1 83.82,14.1
  other vias: 118.24,24.26 94.23,16.89 98.93,28.32 93.22,20.32 100.84,26.42 98.93,30.73 91.57,16.51 96.14,16.64 92.84,17.02
  pour Bottom (isolate 0.254, rank 2): 129.54,10.1 107.54,10.1 107.54,38.1 129.54,38.1
  pour Bottom: 59.18,38.1 76.33,38.1 76.33,10.16 59.18,10.16
  pour Bottom: 79.5,2.54 101.6,2.54 101.6,38.1 79.5,38.73
  pour Top (no thermals): 98.68,25.65 101.09,25.65 101.09,31.11 97.03,31.11 97.03,30.1 98.68,30.1
  pour Top: 90.55,14.99 90.55,22.1 96.65,22.1 96.52,14.99
I2C_VCC
  Top 0.203: R6.2 121.43,30.79 R7.2 121.41,33.14 121.41,33.66 123.29,35.53 JP2.10
IN_L_N
  Top 0.406: JP2.7 124.66,27.91 C9.1
IN_L_P
  Top 0.406: JP2.6 125.03,25.37 C10.1
IN_R_N
  Top 0.406: JP2.4 124.66,20.29 C12.1
IN_R_P
  Top 0.406: JP2.5 125.13,22.83 C11.1
LBO  (via drill 0.39)
  Top 0.254: U1.12 95.05,24.2 v95.5,23.75 96.9,22.35 100.58,22.35 100.84,22.1 100.84,19.18 97.66,19.18 97.16,18.67 97.16,12.7 96.52,12.06 91.56,12.06 Q1.B
  Bottom 0.254: JP1.4 81.41,25.53 83.19,23.75 v95.5,23.75
N$1
  Bottom 0.406: JP5.5 16.76,52.58 18.8,54.61 U4.H1 19.05,59.94 11.68,67.31 U4.V1
N$2
  Top 0.406: U4.B2A 18.29,72.39 18.29,64.01 16.51,62.23 | U4.V3 16.51,62.23 | 16.51,62.23 U4.H3
  Bottom 0.406: JP5.1 26.92,51.82 U4.H3
N$3
  Top 0.406: JP5.4 19.3,50.04 8.89,60.45 8.89,64.77 U4.V2
N$4
  Bottom 0.406: JP5.3 21.84,54.36 U4.H2
N$5
  Top 0.406: U4.B1A 21.34,74.55 21.34,62.74 27.18,56.9 27.18,52.83 24.38,50.04 JP5.2
N$6
  Top 0.203: C10.2 122.21,26.12 121.16,27.18 119.51,27.18 119.25,26.92 119.25,26.24 IC1.P$1
N$7
  Top 0.203: C9.2 119.48,27.91 118.75,27.18 IC1.P$2
N$8
  Top 0.203: C12.2 120.3,20.29 118.75,21.84 IC1.P$14
N$9
  Top 0.203: C11.2 119.3,22.23 IC1.P$15
N$11
  Top 0.305: JP3.9 69.41,15.24
N$12
  Top 0.305: JP3.10 69.41,12.7
N$25
  pour Top (no thermals): 92.84,28.07 92.84,28.96 85.6,28.96 85.6,27.56 89.41,27.56 89.92,28.07
N$26
  Top 0.254: R2.2 94.68,21.72
  Top 0.305: U1.9 92.2,22.48 92.9,21.78 R2.2
  Top 0.61: 94.68,21.72 R1.1
N$27
  Top 0.254: R5.1 100.33,33.65 100.23,33.74 PWR.C
N$28
  Top 0.254: U1.14 96.39,25.98 96.84,25.53 R3.1 | R3.1 97.73,25.4 | R4.2 R3.1
N$29
  Top 0.254: R20.1 98.26,9.4 LBO.A
N$30
  Top 0.254: R20.2 92.78,10.54 89.79,10.54 89.66,10.67 89.66,12.06 89.28,12.45 Q1.C
N$31
  Top 0.254: LED3.C 83.47,11.3 R14.1
N$32  (via drill 0.39)
  Top 0.254: v88.65,10.79 88.13,10.28 88.12,10.29 86.87,10.29 | 86.87,10.29 86.8,10.22 R15.2 | R14.2 86.87,11.24 86.87,10.29 | U3.1 89,18.45 v89.03,18.41
  Bottom 0.254: v89.03,18.41 88.65,18.03 v88.65,10.79
N$33
  Top 0.254: U3.5 R16.1
N$34
  Top 0.254: R15.1 83.5,8 LED4.A
OUT_L_N
  Top 0.254: IC1.P$7 114.11,24.76 113.63,25.24
  Top 0.406: 113.63,25.24 113.63,25.82 arc90 112.9,26.54 111.47,26.54 arc90 J1.1
OUT_L_P
  Top 0.254: IC1.P$6 114.57,25.26 114.43,25.4
  Top 0.406: 114.43,25.4 114.43,27 arc90 J1.2
OUT_R_N
  Top 0.254: IC1.P$9 114.31,23.76 113.54,22.99
  Top 0.406: 113.54,22.99 113.54,22.48 arc-90 112.9,21.84 111.47,21.84 arc90 J2.2
OUT_R_P
  Top 0.254: IC1.P$10 114.82,23.26 114.43,22.86
  Top 0.406: 114.43,22.86 114.43,21.3 arc-90 J2.1
SCL  (via drill 0.39)
  Top 0.203: R6.1 127.73,30.76 JP2.8
  Top 0.254: IC1.P$17 121.15,23.76 v121.41,23.5
  Bottom 0.203: 126.11,25.78 126.11,29.46 127,30.35 127.94,30.35 JP2.8
  Bottom 0.254: v121.41,23.5 121.41,24.77 121.92,25.27 125.6,25.27 126.11,25.78
SCLADC  (via drill 0.5)
  Top 0.254: U2.10 65.8,35.29 v64.77,36.32
  Bottom 0.254: v64.77,36.32 65.79,35.31 65.79,28.7 70.36,24.13 70.36,19.56 72.14,17.78 JP3.8
SDA  (via drill 0.39)
  Top 0.203: JP2.9 123.59,32.99 R7.1
  Top 0.254: IC1.P$19 121.02,24.76 121.28,25.02 v121.28,25.78 | 123.36,33.02 R7.1
  Bottom 0.254: v121.28,25.78 121.28,28.32 122.43,29.46
  Bottom 0.305: 122.43,29.46 125.95,32.99 JP2.9
SDAADC  (via drill 0.5)
  Top 0.254: U2.9 66.3,36.31 v66.29,36.32
  Bottom 0.254: JP3.7 72.14,20.32 70.87,21.59 70.87,24.38 66.29,28.96 v66.29,36.32
SHUTDOWN  (via drill 0.39)
  Top 0.254: v123.19,24.26 IC1.P$18 | 122.68,18.67 R8.1
  Top 0.406: JP2.3 123.35,17.75 R8.1
  Bottom 0.254: v123.19,24.26 126.36,21.08 126.36,18.8 127.38,17.78 127.38,17.75 JP2.3
VBAT  (via drill 0.39)
  Top 0.254: 99.38,20.75 R13.1 99.38,20.64 98.73,19.99 97.59,19.99 96.01,18.41 v96.01,17.78 94.74,19.05 R1.2 | 90.65,13.48 90.42,13.48
  Top 0.406: 86.6,23.24 86.6,23.51
  Top 0.61: 85.79,17.46 U3.3 | Q1.E 90.99,13.42 90.93,13.48 | 88.77,17.14 87.38,17.14
  Top 0.813: C4.1 C1.1
  Top 1.016: B1.2 90.93,13.48 90.42,13.48 89.9,13.48 89.41,13.97 89.41,16.51 88.77,17.14 | JP1.1 85.22,17.78
  Bottom 0.254: v96.01,17.78 93.85,17.78 91.82,19.81 v85.98,19.81
  pour Top (no thermals): 84.96,16.76 85.09,25.27 91.44,25.27 91.44,23.62 87.88,23.75 88.01,16.76
VDD  (via drill 0.39)  (1 unrouted)
  Top 0.254: IC1.P$12 117.74,21.73 117.47,21.46 117.35,21.46 | IC1.P$11 117.24,21.57 117.35,21.46 | 117.35,21.46 116.71,21.46 | IC1.P$4 117.74,27.3 117.47,27.3 | IC1.P$5 117.24,27.29 117.22,27.3 | U2.8 66.8,32.77 66.55,32.51 64.2,32.51
  Top 0.813: JP2.1 125.98,12.67 | 125.98,12.67 125.98,15.88 arc90 125.35,16.51 R8.2 | 117.6,11.3 122.94,11.3 arc90 123.49,11.85 C3.1 arc90 123.69,12.67 125.98,12.67 | C13.1 arc-90 119.41,14.7 C8.1 FB1.1 arc-90 117.6,12.89 117.6,11.3 | 116.71,21.46 v116.2,21.46 arc90 115.44,20.7 115.44,18.92 arc-90 114.81,18.29 114.68,18.29 arc90 113.28,16.51 113.28,12.7 arc90 114.55,11.3 117.6,11.3 | 117.47,27.3 117.22,27.3 v115.95,27.3
  Bottom 0.813: v115.95,27.3 115.95,21.72 v116.2,21.46
VDD1  (via drill 0.39)
  Top 0.254: LED3.A 81.28,11.21 JP4.1
  Top 0.406: X3.VBUS 89.5,9.18 C14.1
  Top 0.61: C14.1 89.6,9.27 v88.27,9.27 | U3.4 84.42,15.85 JP4.1
  Bottom 0.61: v88.27,9.27 84.84,12.7 JP4.1

### Text on the board
tPlace: X | Y | Analog Thumb Joystick | Breakout Board | X and Y act like 10K pots | Xout and Yout are Analog out | Vcc | Xout | Yout | Sel | GND | SEL shorts to ground when pressed | I2C / Vcc | A3 | Class D Stereo / Audio Amp | SDA | A2 | PWR | + | LEFT | SCL | A1 | 5V | GND | L- | A0 | L+ | ALRT | LB | - | R+ | ADDR | GND | R- | SDA | EN | ADS1115 | adafruit | SCL | SHDN | Bat | 500C | RIGHT | + | GND | 16Bit I2C ADC+PGA | GND | GND | Boost | Power | VDD | VDD | USB | TPA2016D2 | Chrg | Low
bPlace: 6dB Default Gain | 1.7W @ 8Ohm | PowerBoost 500 Charger | 2.8W @ 4Ohm | 5Vo | TPS61090 DC Boost | 500mA Charge Current | (per speaker) | Max AIN: VDD | VDD: 2.0-5.5V | Max Output / Pwr @ 5V: | GND | LBO | VDD & I2C Vcc: / 2.5-5.5VDC | GND | 3.2V Low Batt Detect | EN | Apple Charge Resistors | Bat | 500-1000mA from 3.7V LiPo | GND | 5.2V output | TPA2016D2 / Class D / Stereo Amp / w/AGC & I2C / Volume Ctrl | USB